# Altium project TLC5955.PrjPcb
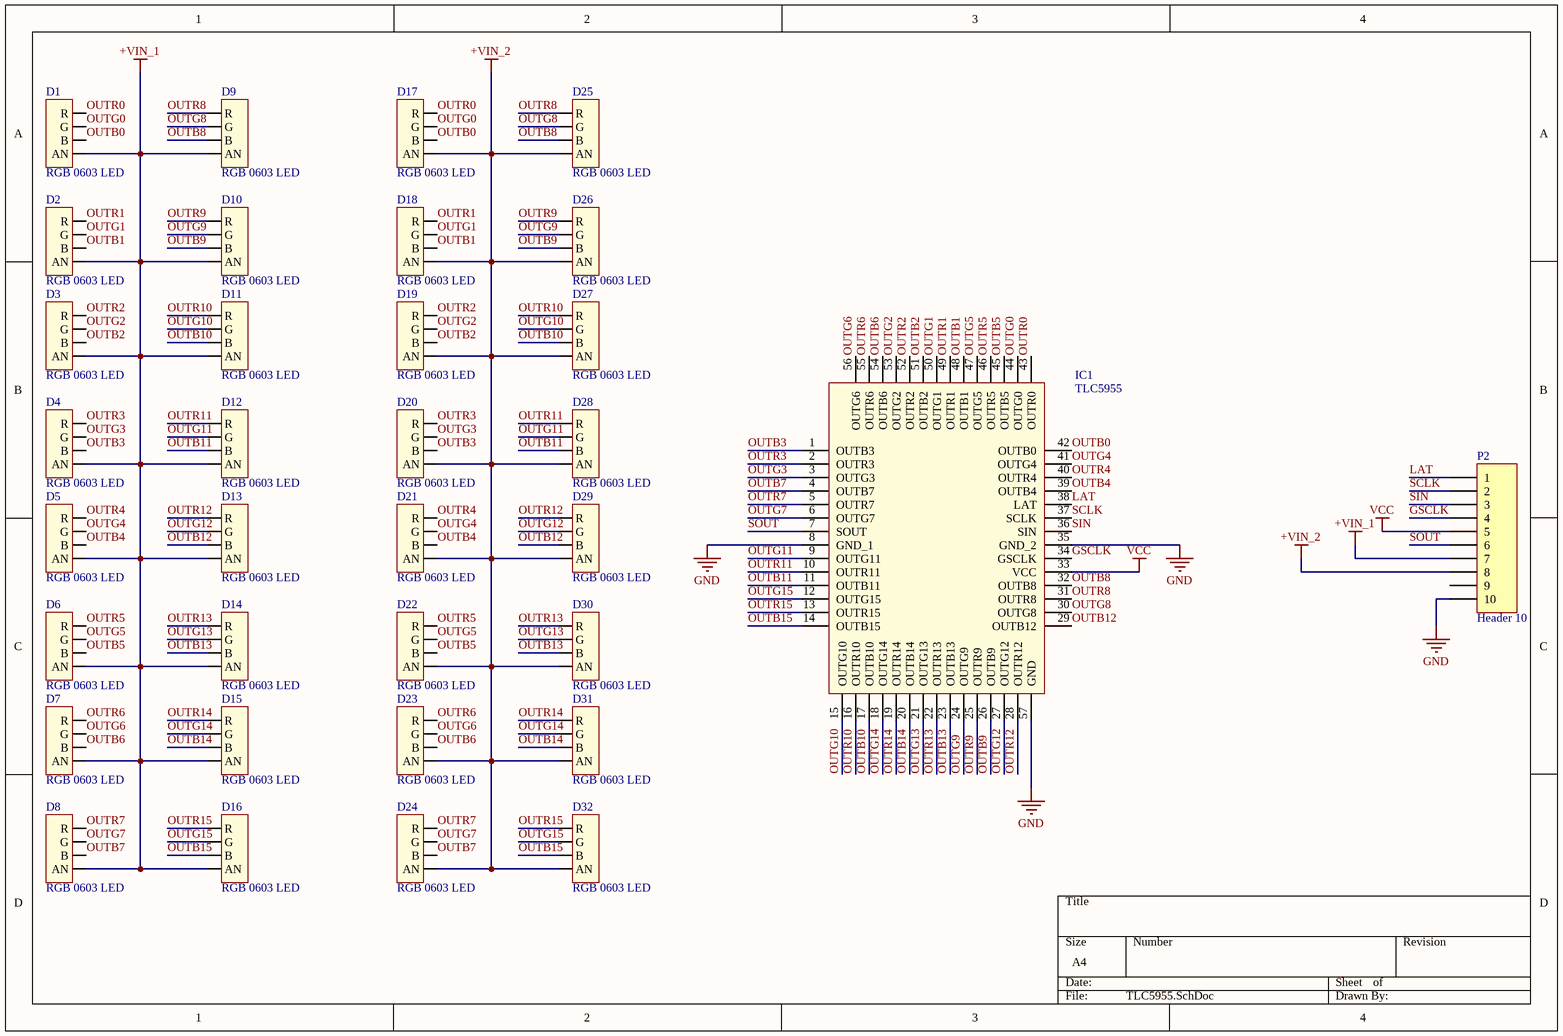
[diagram p0: TLC5955.SchDoc]
4 sheets, 143 parts. Net scope: global (net labels, ports and power ports of the same name join across sheets).
Board file: PCB1.PcbDoc
Sheets:
  TLC5955.SchDoc
  Sheet1.SchDoc
  TLC59581.SchDoc
  Sheet3.SchDoc

## Sheet TLC5955.SchDoc
size A4

### Parts
D1  RGB 0603 LED  [RGB LED]
D2  RGB 0603 LED  [RGB LED]
D3  RGB 0603 LED  [RGB LED]
D4  RGB 0603 LED  [RGB LED]
D5  RGB 0603 LED  [RGB LED]
D6  RGB 0603 LED  [RGB LED]
D7  RGB 0603 LED  [RGB LED]
D8  RGB 0603 LED  [RGB LED]
D9  RGB 0603 LED  [RGB LED]
D10  RGB 0603 LED  [RGB LED]
D11  RGB 0603 LED  [RGB LED]
D12  RGB 0603 LED  [RGB LED]
D13  RGB 0603 LED  [RGB LED]
D14  RGB 0603 LED  [RGB LED]
D15  RGB 0603 LED  [RGB LED]
D16  RGB 0603 LED  [RGB LED]
D17  RGB 0603 LED  [RGB LED]
D18  RGB 0603 LED  [RGB LED]
D19  RGB 0603 LED  [RGB LED]
D20  RGB 0603 LED  [RGB LED]
D21  RGB 0603 LED  [RGB LED]
D22  RGB 0603 LED  [RGB LED]
D23  RGB 0603 LED  [RGB LED]
D24  RGB 0603 LED  [RGB LED]
D25  RGB 0603 LED  [RGB LED]
D26  RGB 0603 LED  [RGB LED]
D27  RGB 0603 LED  [RGB LED]
D28  RGB 0603 LED  [RGB LED]
D29  RGB 0603 LED  [RGB LED]
D30  RGB 0603 LED  [RGB LED]
D31  RGB 0603 LED  [RGB LED]
D32  RGB 0603 LED  [RGB LED]
IC1  TLC5955  [TLC5955]
P2  Header 10  [HDR1X10]

### Nets
+VIN_1: D1.4(AN) D2.4(AN) D3.4(AN) D4.4(AN) D5.4(AN) D6.4(AN) D7.4(AN) D8.4(AN) D9.4(AN) D10.4(AN) D11.4(AN) D12.4(AN) D13.4(AN) D14.4(AN) D15.4(AN) D16.4(AN) P2.7
+VIN_2: D17.4(AN) D18.4(AN) D19.4(AN) D20.4(AN) D21.4(AN) D22.4(AN) D23.4(AN) D24.4(AN) D25.4(AN) D26.4(AN) D27.4(AN) D28.4(AN) D29.4(AN) D30.4(AN) D31.4(AN) D32.4(AN) P2.8
GND: IC1.8(GND_1) IC1.35(GND_2) IC1.57(GND) P2.10
VCC: IC1.33(VCC) P2.5
GSCLK: IC1.34(GSCLK) P2.4
LAT: IC1.38(LAT) P2.1
OUTB0: D1.3(B) D17.3(B) IC1.42(OUTB0)
OUTB1: D2.3(B) D18.3(B) IC1.48(OUTB1)
OUTB2: D3.3(B) D19.3(B) IC1.51(OUTB2)
OUTB3: D4.3(B) D20.3(B) IC1.1(OUTB3)
OUTB4: D5.3(B) D21.3(B) IC1.39(OUTB4)
OUTB5: D6.3(B) D22.3(B) IC1.45(OUTB5)
OUTB6: D7.3(B) D23.3(B) IC1.54(OUTB6)
OUTB7: D8.3(B) D24.3(B) IC1.4(OUTB7)
OUTB8: D9.3(B) D25.3(B) IC1.32(OUTB8)
OUTB9: D10.3(B) D26.3(B) IC1.26(OUTB9)
OUTB10: D11.3(B) D27.3(B) IC1.17(OUTB10)
OUTB11: D12.3(B) D28.3(B) IC1.11(OUTB11)
OUTB12: D13.3(B) D29.3(B) IC1.29(OUTB12)
OUTB13: D14.3(B) D30.3(B) IC1.23(OUTB13)
OUTB14: D15.3(B) D31.3(B) IC1.20(OUTB14)
OUTB15: D16.3(B) D32.3(B) IC1.14(OUTB15)
OUTG0: D1.2(G) D17.2(G) IC1.44(OUTG0)
OUTG1: D2.2(G) D18.2(G) IC1.50(OUTG1)
OUTG2: D3.2(G) D19.2(G) IC1.53(OUTG2)
OUTG3: D4.2(G) D20.2(G) IC1.3(OUTG3)
OUTG4: D5.2(G) D21.2(G) IC1.41(OUTG4)
OUTG5: D6.2(G) D22.2(G) IC1.47(OUTG5)
OUTG6: D7.2(G) D23.2(G) IC1.56(OUTG6)
OUTG7: D8.2(G) D24.2(G) IC1.6(OUTG7)
OUTG8: D9.2(G) D25.2(G) IC1.30(OUTG8)
OUTG9: D10.2(G) D26.2(G) IC1.24(OUTG9)
OUTG10: D11.2(G) D27.2(G) IC1.15(OUTG10)
OUTG11: D12.2(G) D28.2(G) IC1.9(OUTG11)
OUTG12: D13.2(G) D29.2(G) IC1.27(OUTG12)
OUTG13: D14.2(G) D30.2(G) IC1.21(OUTG13)
OUTG14: D15.2(G) D31.2(G) IC1.18(OUTG14)
OUTG15: D16.2(G) D32.2(G) IC1.12(OUTG15)
OUTR0: D1.1(R) D17.1(R) IC1.43(OUTR0)
OUTR1: D2.1(R) D18.1(R) IC1.49(OUTR1)
OUTR2: D3.1(R) D19.1(R) IC1.52(OUTR2)
OUTR3: D4.1(R) D20.1(R) IC1.2(OUTR3)
OUTR4: D5.1(R) D21.1(R) IC1.40(OUTR4)
OUTR5: D6.1(R) D22.1(R) IC1.46(OUTR5)
OUTR6: D7.1(R) D23.1(R) IC1.55(OUTR6)
OUTR7: D8.1(R) D24.1(R) IC1.5(OUTR7)
OUTR8: D9.1(R) D25.1(R) IC1.31(OUTR8)
OUTR9: D10.1(R) D26.1(R) IC1.25(OUTR9)
OUTR10: D11.1(R) D27.1(R) IC1.16(OUTR10)
OUTR11: D12.1(R) D28.1(R) IC1.10(OUTR11)
OUTR12: D13.1(R) D29.1(R) IC1.28(OUTR12)
OUTR13: D14.1(R) D30.1(R) IC1.22(OUTR13)
OUTR14: D15.1(R) D31.1(R) IC1.19(OUTR14)
OUTR15: D16.1(R) D32.1(R) IC1.13(OUTR15)
SCLK: IC1.37(SCLK) P2.2
SIN: IC1.36(SIN) P2.3
SOUT: IC1.7(SOUT) P2.6

Not connected (* = marked no-connect by the designer): P2 9

### Library data of the parts
P2 = Header 10: Header, 10-Pin; LatestRevisionDate: 17-Jul-2002; LatestRevisionNote: Re-released for DXP Platform.; Publisher: Altium Limited

## Sheet Sheet1.SchDoc
size A4
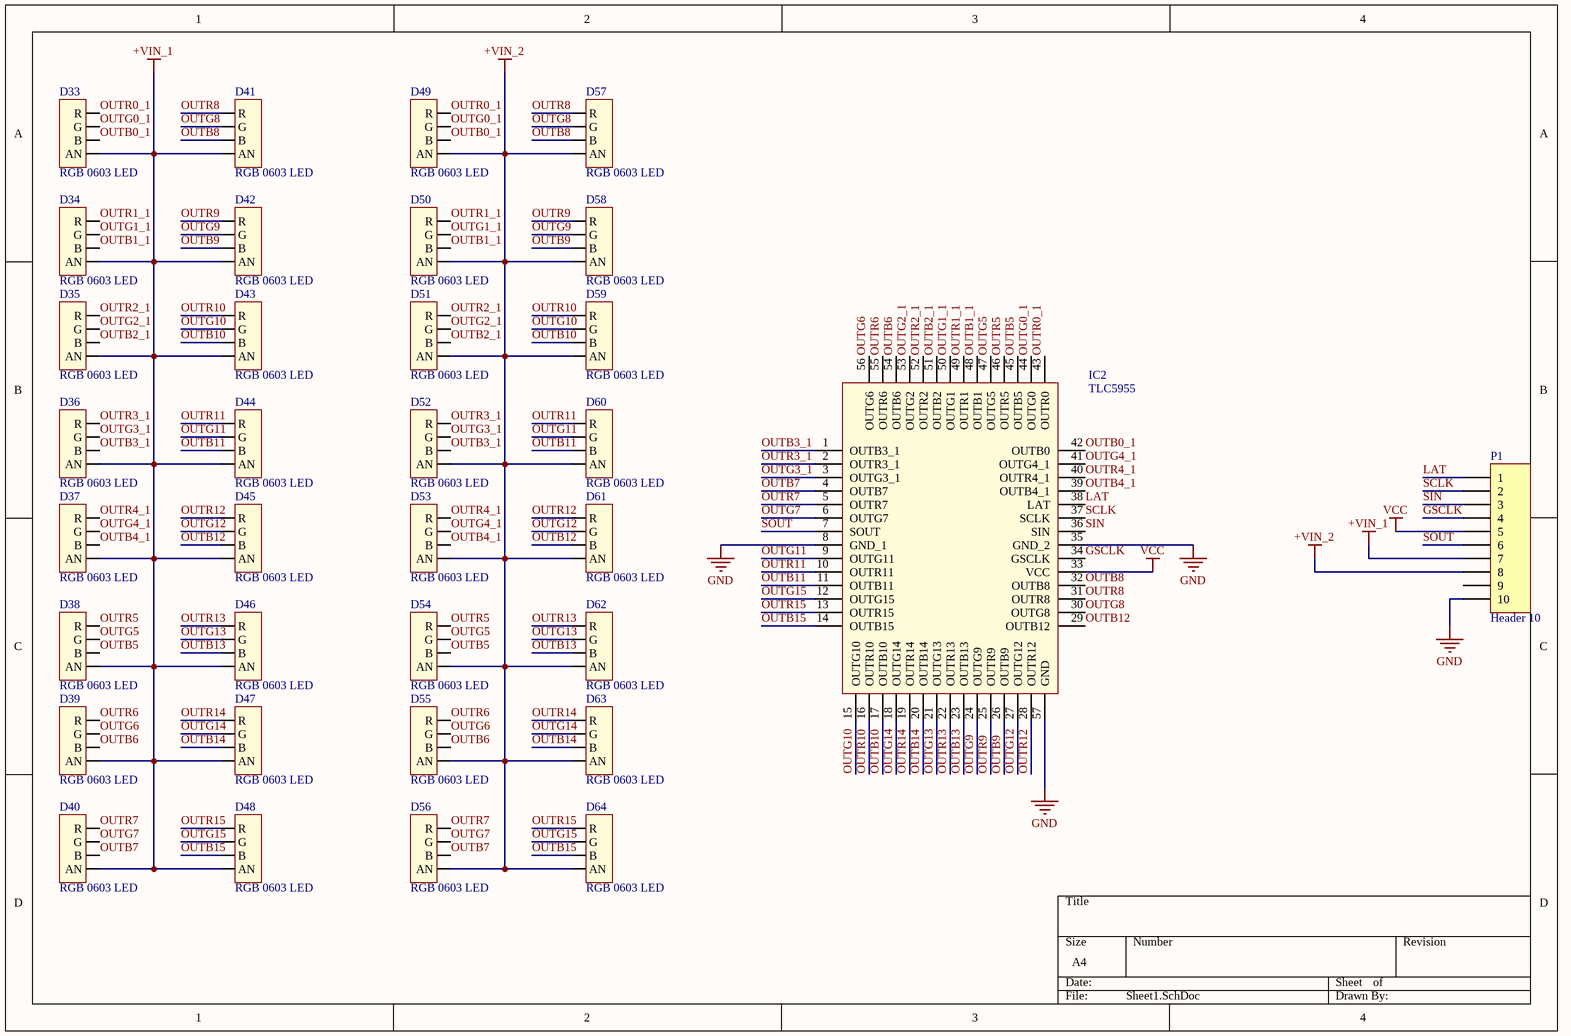
[diagram p1: Sheet1.SchDoc]

### Parts
D33  RGB 0603 LED  [RGB LED]
D34  RGB 0603 LED  [RGB LED]
D35  RGB 0603 LED  [RGB LED]
D36  RGB 0603 LED  [RGB LED]
D37  RGB 0603 LED  [RGB LED]
D38  RGB 0603 LED  [RGB LED]
D39  RGB 0603 LED  [RGB LED]
D40  RGB 0603 LED  [RGB LED]
D41  RGB 0603 LED  [RGB LED]
D42  RGB 0603 LED  [RGB LED]
D43  RGB 0603 LED  [RGB LED]
D44  RGB 0603 LED  [RGB LED]
D45  RGB 0603 LED  [RGB LED]
D46  RGB 0603 LED  [RGB LED]
D47  RGB 0603 LED  [RGB LED]
D48  RGB 0603 LED  [RGB LED]
D49  RGB 0603 LED  [RGB LED]
D50  RGB 0603 LED  [RGB LED]
D51  RGB 0603 LED  [RGB LED]
D52  RGB 0603 LED  [RGB LED]
D53  RGB 0603 LED  [RGB LED]
D54  RGB 0603 LED  [RGB LED]
D55  RGB 0603 LED  [RGB LED]
D56  RGB 0603 LED  [RGB LED]
D57  RGB 0603 LED  [RGB LED]
D58  RGB 0603 LED  [RGB LED]
D59  RGB 0603 LED  [RGB LED]
D60  RGB 0603 LED  [RGB LED]
D61  RGB 0603 LED  [RGB LED]
D62  RGB 0603 LED  [RGB LED]
D63  RGB 0603 LED  [RGB LED]
D64  RGB 0603 LED  [RGB LED]
IC2  TLC5955  [TLC5955]
P1  Header 10  [HDR1X10]

### Nets
+VIN_1: D33.4(AN) D34.4(AN) D35.4(AN) D36.4(AN) D37.4(AN) D38.4(AN) D39.4(AN) D40.4(AN) D41.4(AN) D42.4(AN) D43.4(AN) D44.4(AN) D45.4(AN) D46.4(AN) D47.4(AN) D48.4(AN) P1.7
+VIN_2: D49.4(AN) D50.4(AN) D51.4(AN) D52.4(AN) D53.4(AN) D54.4(AN) D55.4(AN) D56.4(AN) D57.4(AN) D58.4(AN) D59.4(AN) D60.4(AN) D61.4(AN) D62.4(AN) D63.4(AN) D64.4(AN) P1.8
GND: IC2.8(GND_1) IC2.35(GND_2) IC2.57(GND) P1.10
VCC: IC2.33(VCC) P1.5
GSCLK: IC2.34(GSCLK) P1.4
LAT: IC2.38(LAT) P1.1
OUTB0_1: D33.3(B) D49.3(B) IC2.42(OUTB0)
OUTB1_1: D34.3(B) D50.3(B) IC2.48(OUTB1)
OUTB2_1: D35.3(B) D51.3(B) IC2.51(OUTB2)
OUTB3_1: D36.3(B) D52.3(B) IC2.1(OUTB3_1)
OUTB4_1: D37.3(B) D53.3(B) IC2.39(OUTB4_1)
OUTB5: D38.3(B) D54.3(B) IC2.45(OUTB5)
OUTB6: D39.3(B) D55.3(B) IC2.54(OUTB6)
OUTB7: D40.3(B) D56.3(B) IC2.4(OUTB7)
OUTB8: D41.3(B) D57.3(B) IC2.32(OUTB8)
OUTB9: D42.3(B) D58.3(B) IC2.26(OUTB9)
OUTB10: D43.3(B) D59.3(B) IC2.17(OUTB10)
OUTB11: D44.3(B) D60.3(B) IC2.11(OUTB11)
OUTB12: D45.3(B) D61.3(B) IC2.29(OUTB12)
OUTB13: D46.3(B) D62.3(B) IC2.23(OUTB13)
OUTB14: D47.3(B) D63.3(B) IC2.20(OUTB14)
OUTB15: D48.3(B) D64.3(B) IC2.14(OUTB15)
OUTG0_1: D33.2(G) D49.2(G) IC2.44(OUTG0)
OUTG1_1: D34.2(G) D50.2(G) IC2.50(OUTG1)
OUTG2_1: D35.2(G) D51.2(G) IC2.53(OUTG2)
OUTG3_1: D36.2(G) D52.2(G) IC2.3(OUTG3_1)
OUTG4_1: D37.2(G) D53.2(G) IC2.41(OUTG4_1)
OUTG5: D38.2(G) D54.2(G) IC2.47(OUTG5)
OUTG6: D39.2(G) D55.2(G) IC2.56(OUTG6)
OUTG7: D40.2(G) D56.2(G) IC2.6(OUTG7)
OUTG8: D41.2(G) D57.2(G) IC2.30(OUTG8)
OUTG9: D42.2(G) D58.2(G) IC2.24(OUTG9)
OUTG10: D43.2(G) D59.2(G) IC2.15(OUTG10)
OUTG11: D44.2(G) D60.2(G) IC2.9(OUTG11)
OUTG12: D45.2(G) D61.2(G) IC2.27(OUTG12)
OUTG13: D46.2(G) D62.2(G) IC2.21(OUTG13)
OUTG14: D47.2(G) D63.2(G) IC2.18(OUTG14)
OUTG15: D48.2(G) D64.2(G) IC2.12(OUTG15)
OUTR0_1: D33.1(R) D49.1(R) IC2.43(OUTR0)
OUTR1_1: D34.1(R) D50.1(R) IC2.49(OUTR1)
OUTR2_1: D35.1(R) D51.1(R) IC2.52(OUTR2)
OUTR3_1: D36.1(R) D52.1(R) IC2.2(OUTR3_1)
OUTR4_1: D37.1(R) D53.1(R) IC2.40(OUTR4_1)
OUTR5: D38.1(R) D54.1(R) IC2.46(OUTR5)
OUTR6: D39.1(R) D55.1(R) IC2.55(OUTR6)
OUTR7: D40.1(R) D56.1(R) IC2.5(OUTR7)
OUTR8: D41.1(R) D57.1(R) IC2.31(OUTR8)
OUTR9: D42.1(R) D58.1(R) IC2.25(OUTR9)
OUTR10: D43.1(R) D59.1(R) IC2.16(OUTR10)
OUTR11: D44.1(R) D60.1(R) IC2.10(OUTR11)
OUTR12: D45.1(R) D61.1(R) IC2.28(OUTR12)
OUTR13: D46.1(R) D62.1(R) IC2.22(OUTR13)
OUTR14: D47.1(R) D63.1(R) IC2.19(OUTR14)
OUTR15: D48.1(R) D64.1(R) IC2.13(OUTR15)
SCLK: IC2.37(SCLK) P1.2
SIN: IC2.36(SIN) P1.3
SOUT: IC2.7(SOUT) P1.6

Not connected (* = marked no-connect by the designer): P1 9

### Library data of the parts
P1 = Header 10: Header, 10-Pin; LatestRevisionDate: 17-Jul-2002; LatestRevisionNote: Re-released for DXP Platform.; Publisher: Altium Limited

## Sheet TLC59581.SchDoc
size A4
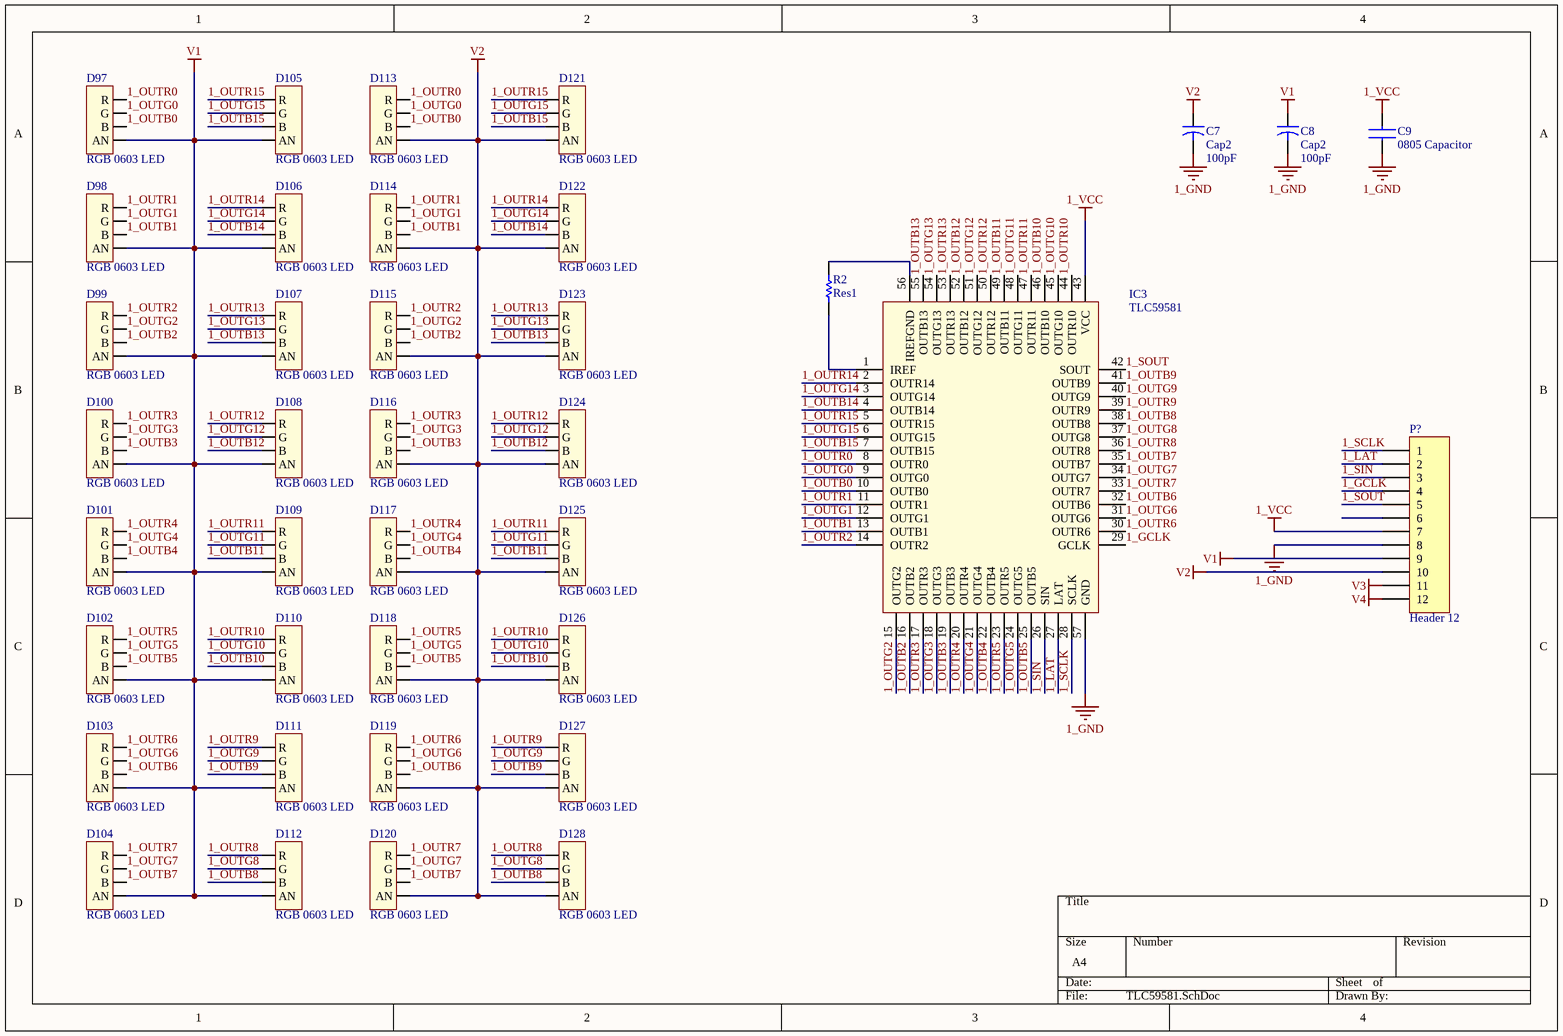
[diagram p2: TLC59581.SchDoc]

### Parts
C7  Cap2  value 100pF  [CAPR5-4X5]
C8  Cap2  value 100pF  [CAPR5-4X5]
C9  0805 Capacitor  [0805 Capacitor]
D97  RGB 0603 LED  [RGB LED]
D98  RGB 0603 LED  [RGB LED]
D99  RGB 0603 LED  [RGB LED]
D100  RGB 0603 LED  [RGB LED]
D101  RGB 0603 LED  [RGB LED]
D102  RGB 0603 LED  [RGB LED]
D103  RGB 0603 LED  [RGB LED]
D104  RGB 0603 LED  [RGB LED]
D105  RGB 0603 LED  [RGB LED]
D106  RGB 0603 LED  [RGB LED]
D107  RGB 0603 LED  [RGB LED]
D108  RGB 0603 LED  [RGB LED]
D109  RGB 0603 LED  [RGB LED]
D110  RGB 0603 LED  [RGB LED]
D111  RGB 0603 LED  [RGB LED]
D112  RGB 0603 LED  [RGB LED]
D113  RGB 0603 LED  [RGB LED]
D114  RGB 0603 LED  [RGB LED]
D115  RGB 0603 LED  [RGB LED]
D116  RGB 0603 LED  [RGB LED]
D117  RGB 0603 LED  [RGB LED]
D118  RGB 0603 LED  [RGB LED]
D119  RGB 0603 LED  [RGB LED]
D120  RGB 0603 LED  [RGB LED]
D121  RGB 0603 LED  [RGB LED]
D122  RGB 0603 LED  [RGB LED]
D123  RGB 0603 LED  [RGB LED]
D124  RGB 0603 LED  [RGB LED]
D125  RGB 0603 LED  [RGB LED]
D126  RGB 0603 LED  [RGB LED]
D127  RGB 0603 LED  [RGB LED]
D128  RGB 0603 LED  [RGB LED]
IC3  TLC59581  [TLC59581]
P?  Header 12  [HDR1X12]
R2  Res1  [AXIAL-0.3]

### Nets
1_GND: C7.2 C8.2 C9.1 IC3.57(GND) P?.8
1_VCC: C9.2 IC3.43(VCC) P?.7
V1: C8.1 D97.4(AN) D98.4(AN) D99.4(AN) D100.4(AN) D101.4(AN) D102.4(AN) D103.4(AN) D104.4(AN) D105.4(AN) D106.4(AN) D107.4(AN) D108.4(AN) D109.4(AN) D110.4(AN) D111.4(AN) D112.4(AN) P?.9
V2: C7.1 D113.4(AN) D114.4(AN) D115.4(AN) D116.4(AN) D117.4(AN) D118.4(AN) D119.4(AN) D120.4(AN) D121.4(AN) D122.4(AN) D123.4(AN) D124.4(AN) D125.4(AN) D126.4(AN) D127.4(AN) D128.4(AN) P?.10
V3: P?.11
V4: P?.12
1_GCLK: IC3.29(GCLK) P?.4
1_LAT: IC3.27(LAT) P?.2
1_OUTB0: D97.3(B) D113.3(B) IC3.10(OUTB0)
1_OUTB1: D98.3(B) D114.3(B) IC3.13(OUTB1)
1_OUTB2: D99.3(B) D115.3(B) IC3.16(OUTB2)
1_OUTB3: D100.3(B) D116.3(B) IC3.19(OUTB3)
1_OUTB4: D101.3(B) D117.3(B) IC3.22(OUTB4)
1_OUTB5: D102.3(B) D118.3(B) IC3.25(OUTB5)
1_OUTB6: D103.3(B) D119.3(B) IC3.32(OUTB6)
1_OUTB7: D104.3(B) D120.3(B) IC3.35(OUTB7)
1_OUTB8: D112.3(B) D128.3(B) IC3.38(OUTB8)
1_OUTB9: D111.3(B) D127.3(B) IC3.41(OUTB9)
1_OUTB10: D110.3(B) D126.3(B) IC3.46(OUTB10)
1_OUTB11: D109.3(B) D125.3(B) IC3.49(OUTB11)
1_OUTB12: D108.3(B) D124.3(B) IC3.52(OUTB12)
1_OUTB13: D107.3(B) D123.3(B) IC3.55(OUTB13)
1_OUTB14: D106.3(B) D122.3(B) IC3.4(OUTB14)
1_OUTB15: D105.3(B) D121.3(B) IC3.7(OUTB15)
1_OUTG0: D97.2(G) D113.2(G) IC3.9(OUTG0)
1_OUTG1: D98.2(G) D114.2(G) IC3.12(OUTG1)
1_OUTG2: D99.2(G) D115.2(G) IC3.15(OUTG2)
1_OUTG3: D100.2(G) D116.2(G) IC3.18(OUTG3)
1_OUTG4: D101.2(G) D117.2(G) IC3.21(OUTG4)
1_OUTG5: D102.2(G) D118.2(G) IC3.24(OUTG5)
1_OUTG6: D103.2(G) D119.2(G) IC3.31(OUTG6)
1_OUTG7: D104.2(G) D120.2(G) IC3.34(OUTG7)
1_OUTG8: D112.2(G) D128.2(G) IC3.37(OUTG8)
1_OUTG9: D111.2(G) D127.2(G) IC3.40(OUTG9)
1_OUTG10: D110.2(G) D126.2(G) IC3.45(OUTG10)
1_OUTG11: D109.2(G) D125.2(G) IC3.48(OUTG11)
1_OUTG12: D108.2(G) D124.2(G) IC3.51(OUTG12)
1_OUTG13: D107.2(G) D123.2(G) IC3.54(OUTG13)
1_OUTG14: D106.2(G) D122.2(G) IC3.3(OUTG14)
1_OUTG15: D105.2(G) D121.2(G) IC3.6(OUTG15)
1_OUTR0: D97.1(R) D113.1(R) IC3.8(OUTR0)
1_OUTR1: D98.1(R) D114.1(R) IC3.11(OUTR1)
1_OUTR2: D99.1(R) D115.1(R) IC3.14(OUTR2)
1_OUTR3: D100.1(R) D116.1(R) IC3.17(OUTR3)
1_OUTR4: D101.1(R) D117.1(R) IC3.20(OUTR4)
1_OUTR5: D102.1(R) D118.1(R) IC3.23(OUTR5)
1_OUTR6: D103.1(R) D119.1(R) IC3.30(OUTR6)
1_OUTR7: D104.1(R) D120.1(R) IC3.33(OUTR7)
1_OUTR8: D112.1(R) D128.1(R) IC3.36(OUTR8)
1_OUTR9: D111.1(R) D127.1(R) IC3.39(OUTR9)
1_OUTR10: D110.1(R) D126.1(R) IC3.44(OUTR10)
1_OUTR11: D109.1(R) D125.1(R) IC3.47(OUTR11)
1_OUTR12: D108.1(R) D124.1(R) IC3.50(OUTR12)
1_OUTR13: D107.1(R) D123.1(R) IC3.53(OUTR13)
1_OUTR14: D106.1(R) D122.1(R) IC3.2(OUTR14)
1_OUTR15: D105.1(R) D121.1(R) IC3.5(OUTR15)
1_SCLK: IC3.28(SCLK) P?.1
1_SIN: IC3.26(SIN) P?.3
1_SOUT: IC3.42(SOUT) P?.5
NetIC3_1: IC3.1(IREF) R2.1
NetIC3_56: IC3.56(IREFGND) R2.2

Not connected (* = marked no-connect by the designer): P? 6

### Library data of the parts
C7 C8 = Cap2: Capacitor; Published: 23-Sep-2002; PackageReference: CAPR5-4X5; Publisher: Altium Limited; PackageDescription: Capacitor; 2 Leads
P? = Header 12: Header, 12-Pin; LatestRevisionDate: 17-Jul-2002; LatestRevisionNote: Re-released for DXP Platform.; Publisher: Altium Limited
R2 = Res1: Resistor; Published: 8-Jun-2000; LatestRevisionDate: 17-Jul-2002; LatestRevisionNote: Re-released for DXP Platform.; PackageReference: AXIAL-0.3; Publisher: Altium Limited; PackageDescription: Axial Device, Thru-Hole; 2 Leads; 0.3 in Pin Spacing

## Sheet Sheet3.SchDoc
size A4
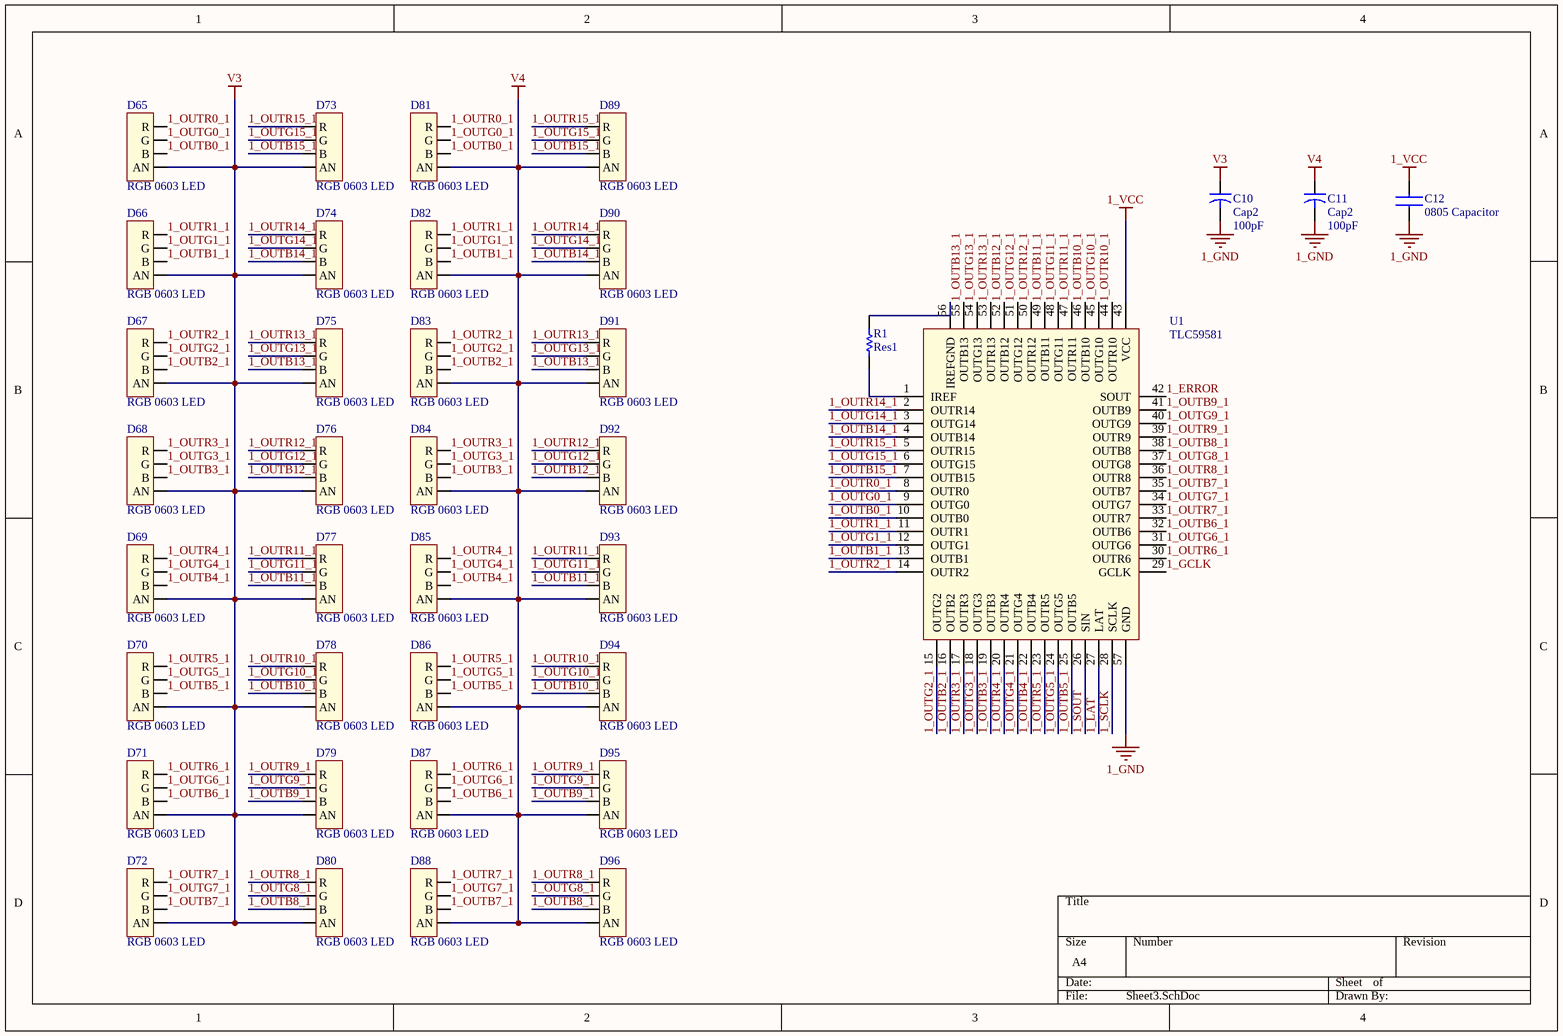
[diagram p3: Sheet3.SchDoc]

### Parts
C10  Cap2  value 100pF  [CAPR5-4X5]
C11  Cap2  value 100pF  [CAPR5-4X5]
C12  0805 Capacitor  [0805 Capacitor]
D65  RGB 0603 LED  [RGB LED]
D66  RGB 0603 LED  [RGB LED]
D67  RGB 0603 LED  [RGB LED]
D68  RGB 0603 LED  [RGB LED]
D69  RGB 0603 LED  [RGB LED]
D70  RGB 0603 LED  [RGB LED]
D71  RGB 0603 LED  [RGB LED]
D72  RGB 0603 LED  [RGB LED]
D73  RGB 0603 LED  [RGB LED]
D74  RGB 0603 LED  [RGB LED]
D75  RGB 0603 LED  [RGB LED]
D76  RGB 0603 LED  [RGB LED]
D77  RGB 0603 LED  [RGB LED]
D78  RGB 0603 LED  [RGB LED]
D79  RGB 0603 LED  [RGB LED]
D80  RGB 0603 LED  [RGB LED]
D81  RGB 0603 LED  [RGB LED]
D82  RGB 0603 LED  [RGB LED]
D83  RGB 0603 LED  [RGB LED]
D84  RGB 0603 LED  [RGB LED]
D85  RGB 0603 LED  [RGB LED]
D86  RGB 0603 LED  [RGB LED]
D87  RGB 0603 LED  [RGB LED]
D88  RGB 0603 LED  [RGB LED]
D89  RGB 0603 LED  [RGB LED]
D90  RGB 0603 LED  [RGB LED]
D91  RGB 0603 LED  [RGB LED]
D92  RGB 0603 LED  [RGB LED]
D93  RGB 0603 LED  [RGB LED]
D94  RGB 0603 LED  [RGB LED]
D95  RGB 0603 LED  [RGB LED]
D96  RGB 0603 LED  [RGB LED]
R1  Res1  [AXIAL-0.3]
U1  TLC59581  [TLC59581]

### Nets
1_GND: C10.2 C11.2 C12.1 U1.57(GND)
1_VCC: C12.2 U1.43(VCC)
V3: C10.1 D65.4(AN) D66.4(AN) D67.4(AN) D68.4(AN) D69.4(AN) D70.4(AN) D71.4(AN) D72.4(AN) D73.4(AN) D74.4(AN) D75.4(AN) D76.4(AN) D77.4(AN) D78.4(AN) D79.4(AN) D80.4(AN)
V4: C11.1 D81.4(AN) D82.4(AN) D83.4(AN) D84.4(AN) D85.4(AN) D86.4(AN) D87.4(AN) D88.4(AN) D89.4(AN) D90.4(AN) D91.4(AN) D92.4(AN) D93.4(AN) D94.4(AN) D95.4(AN) D96.4(AN)
1_ERROR: U1.42(SOUT)
1_GCLK: U1.29(GCLK)
1_LAT: U1.27(LAT)
1_OUTB0_1: D65.3(B) D81.3(B) U1.10(OUTB0)
1_OUTB1_1: D66.3(B) D82.3(B) U1.13(OUTB1)
1_OUTB2_1: D67.3(B) D83.3(B) U1.16(OUTB2)
1_OUTB3_1: D68.3(B) D84.3(B) U1.19(OUTB3)
1_OUTB4_1: D69.3(B) D85.3(B) U1.22(OUTB4)
1_OUTB5_1: D70.3(B) D86.3(B) U1.25(OUTB5)
1_OUTB6_1: D71.3(B) D87.3(B) U1.32(OUTB6)
1_OUTB7_1: D72.3(B) D88.3(B) U1.35(OUTB7)
1_OUTB8_1: D80.3(B) D96.3(B) U1.38(OUTB8)
1_OUTB9_1: D79.3(B) D95.3(B) U1.41(OUTB9)
1_OUTB10_1: D78.3(B) D94.3(B) U1.46(OUTB10)
1_OUTB11_1: D77.3(B) D93.3(B) U1.49(OUTB11)
1_OUTB12_1: D76.3(B) D92.3(B) U1.52(OUTB12)
1_OUTB13_1: D75.3(B) D91.3(B) U1.55(OUTB13)
1_OUTB14_1: D74.3(B) D90.3(B) U1.4(OUTB14)
1_OUTB15_1: D73.3(B) D89.3(B) U1.7(OUTB15)
1_OUTG0_1: D65.2(G) D81.2(G) U1.9(OUTG0)
1_OUTG1_1: D66.2(G) D82.2(G) U1.12(OUTG1)
1_OUTG2_1: D67.2(G) D83.2(G) U1.15(OUTG2)
1_OUTG3_1: D68.2(G) D84.2(G) U1.18(OUTG3)
1_OUTG4_1: D69.2(G) D85.2(G) U1.21(OUTG4)
1_OUTG5_1: D70.2(G) D86.2(G) U1.24(OUTG5)
1_OUTG6_1: D71.2(G) D87.2(G) U1.31(OUTG6)
1_OUTG7_1: D72.2(G) D88.2(G) U1.34(OUTG7)
1_OUTG8_1: D80.2(G) D96.2(G) U1.37(OUTG8)
1_OUTG9_1: D79.2(G) D95.2(G) U1.40(OUTG9)
1_OUTG10_1: D78.2(G) D94.2(G) U1.45(OUTG10)
1_OUTG11_1: D77.2(G) D93.2(G) U1.48(OUTG11)
1_OUTG12_1: D76.2(G) D92.2(G) U1.51(OUTG12)
1_OUTG13_1: D75.2(G) D91.2(G) U1.54(OUTG13)
1_OUTG14_1: D74.2(G) D90.2(G) U1.3(OUTG14)
1_OUTG15_1: D73.2(G) D89.2(G) U1.6(OUTG15)
1_OUTR0_1: D65.1(R) D81.1(R) U1.8(OUTR0)
1_OUTR1_1: D66.1(R) D82.1(R) U1.11(OUTR1)
1_OUTR2_1: D67.1(R) D83.1(R) U1.14(OUTR2)
1_OUTR3_1: D68.1(R) D84.1(R) U1.17(OUTR3)
1_OUTR4_1: D69.1(R) D85.1(R) U1.20(OUTR4)
1_OUTR5_1: D70.1(R) D86.1(R) U1.23(OUTR5)
1_OUTR6_1: D71.1(R) D87.1(R) U1.30(OUTR6)
1_OUTR7_1: D72.1(R) D88.1(R) U1.33(OUTR7)
1_OUTR8_1: D80.1(R) D96.1(R) U1.36(OUTR8)
1_OUTR9_1: D79.1(R) D95.1(R) U1.39(OUTR9)
1_OUTR10_1: D78.1(R) D94.1(R) U1.44(OUTR10)
1_OUTR11_1: D77.1(R) D93.1(R) U1.47(OUTR11)
1_OUTR12_1: D76.1(R) D92.1(R) U1.50(OUTR12)
1_OUTR13_1: D75.1(R) D91.1(R) U1.53(OUTR13)
1_OUTR14_1: D74.1(R) D90.1(R) U1.2(OUTR14)
1_OUTR15_1: D73.1(R) D89.1(R) U1.5(OUTR15)
1_SCLK: U1.28(SCLK)
1_SOUT: U1.26(SIN)
NetR1_1: R1.1 U1.1(IREF)
NetR1_2: R1.2 U1.56(IREFGND)

### Library data of the parts
C10 C11 = Cap2: Capacitor; Published: 23-Sep-2002; PackageReference: CAPR5-4X5; Publisher: Altium Limited; PackageDescription: Capacitor; 2 Leads
R1 = Res1: Resistor; Published: 8-Jun-2000; LatestRevisionDate: 17-Jul-2002; LatestRevisionNote: Re-released for DXP Platform.; PackageReference: AXIAL-0.3; Publisher: Altium Limited; PackageDescription: Axial Device, Thru-Hole; 2 Leads; 0.3 in Pin Spacing

## Nets that join several sheets
1_GND: TLC59581 (5 pins), Sheet3 (C10.2 C11.2 C12.1 U1.57)
1_VCC: TLC59581 (C9.2 IC3.43 P?.7), Sheet3 (C12.2 U1.43)
+VIN_1: TLC5955 (17 pins), Sheet1 (17 pins)
+VIN_2: TLC5955 (17 pins), Sheet1 (17 pins)
GND: TLC5955 (IC1.8 IC1.35 IC1.57 P2.10), Sheet1 (IC2.8 IC2.35 IC2.57 P1.10)
V3: TLC59581 (P?.11), Sheet3 (17 pins)
V4: TLC59581 (P?.12), Sheet3 (17 pins)
VCC: TLC5955 (IC1.33 P2.5), Sheet1 (IC2.33 P1.5)
1_GCLK: TLC59581 (IC3.29 P?.4), Sheet3 (U1.29)
1_LAT: TLC59581 (IC3.27 P?.2), Sheet3 (U1.27)
1_SCLK: TLC59581 (IC3.28 P?.1), Sheet3 (U1.28)
1_SOUT: TLC59581 (IC3.42 P?.5), Sheet3 (U1.26)
GSCLK: TLC5955 (IC1.34 P2.4), Sheet1 (IC2.34 P1.4)
LAT: TLC5955 (IC1.38 P2.1), Sheet1 (IC2.38 P1.1)
OUTB5: TLC5955 (D6.3 D22.3 IC1.45), Sheet1 (D38.3 D54.3 IC2.45)
OUTB6: TLC5955 (D7.3 D23.3 IC1.54), Sheet1 (D39.3 D55.3 IC2.54)
OUTB7: TLC5955 (D8.3 D24.3 IC1.4), Sheet1 (D40.3 D56.3 IC2.4)
OUTB8: TLC5955 (D9.3 D25.3 IC1.32), Sheet1 (D41.3 D57.3 IC2.32)
OUTB9: TLC5955 (D10.3 D26.3 IC1.26), Sheet1 (D42.3 D58.3 IC2.26)
OUTB10: TLC5955 (D11.3 D27.3 IC1.17), Sheet1 (D43.3 D59.3 IC2.17)
OUTB11: TLC5955 (D12.3 D28.3 IC1.11), Sheet1 (D44.3 D60.3 IC2.11)
OUTB12: TLC5955 (D13.3 D29.3 IC1.29), Sheet1 (D45.3 D61.3 IC2.29)
OUTB13: TLC5955 (D14.3 D30.3 IC1.23), Sheet1 (D46.3 D62.3 IC2.23)
OUTB14: TLC5955 (D15.3 D31.3 IC1.20), Sheet1 (D47.3 D63.3 IC2.20)
OUTB15: TLC5955 (D16.3 D32.3 IC1.14), Sheet1 (D48.3 D64.3 IC2.14)
OUTG5: TLC5955 (D6.2 D22.2 IC1.47), Sheet1 (D38.2 D54.2 IC2.47)
OUTG6: TLC5955 (D7.2 D23.2 IC1.56), Sheet1 (D39.2 D55.2 IC2.56)
OUTG7: TLC5955 (D8.2 D24.2 IC1.6), Sheet1 (D40.2 D56.2 IC2.6)
OUTG8: TLC5955 (D9.2 D25.2 IC1.30), Sheet1 (D41.2 D57.2 IC2.30)
OUTG9: TLC5955 (D10.2 D26.2 IC1.24), Sheet1 (D42.2 D58.2 IC2.24)
OUTG10: TLC5955 (D11.2 D27.2 IC1.15), Sheet1 (D43.2 D59.2 IC2.15)
OUTG11: TLC5955 (D12.2 D28.2 IC1.9), Sheet1 (D44.2 D60.2 IC2.9)
OUTG12: TLC5955 (D13.2 D29.2 IC1.27), Sheet1 (D45.2 D61.2 IC2.27)
OUTG13: TLC5955 (D14.2 D30.2 IC1.21), Sheet1 (D46.2 D62.2 IC2.21)
OUTG14: TLC5955 (D15.2 D31.2 IC1.18), Sheet1 (D47.2 D63.2 IC2.18)
OUTG15: TLC5955 (D16.2 D32.2 IC1.12), Sheet1 (D48.2 D64.2 IC2.12)
OUTR5: TLC5955 (D6.1 D22.1 IC1.46), Sheet1 (D38.1 D54.1 IC2.46)
OUTR6: TLC5955 (D7.1 D23.1 IC1.55), Sheet1 (D39.1 D55.1 IC2.55)
OUTR7: TLC5955 (D8.1 D24.1 IC1.5), Sheet1 (D40.1 D56.1 IC2.5)
OUTR8: TLC5955 (D9.1 D25.1 IC1.31), Sheet1 (D41.1 D57.1 IC2.31)
OUTR9: TLC5955 (D10.1 D26.1 IC1.25), Sheet1 (D42.1 D58.1 IC2.25)
OUTR10: TLC5955 (D11.1 D27.1 IC1.16), Sheet1 (D43.1 D59.1 IC2.16)
OUTR11: TLC5955 (D12.1 D28.1 IC1.10), Sheet1 (D44.1 D60.1 IC2.10)
OUTR12: TLC5955 (D13.1 D29.1 IC1.28), Sheet1 (D45.1 D61.1 IC2.28)
OUTR13: TLC5955 (D14.1 D30.1 IC1.22), Sheet1 (D46.1 D62.1 IC2.22)
OUTR14: TLC5955 (D15.1 D31.1 IC1.19), Sheet1 (D47.1 D63.1 IC2.19)
OUTR15: TLC5955 (D16.1 D32.1 IC1.13), Sheet1 (D48.1 D64.1 IC2.13)
SCLK: TLC5955 (IC1.37 P2.2), Sheet1 (IC2.37 P1.2)
SIN: TLC5955 (IC1.36 P2.3), Sheet1 (IC2.36 P1.3)
SOUT: TLC5955 (IC1.7 P2.6), Sheet1 (IC2.7 P1.6)